# EAGLE schematic LDR (EAGLE 7.2.0)
CNAME: LDR configurations; CREVISION: 1.0; DESIGNER: S.j.de.Bakker@hr.nl
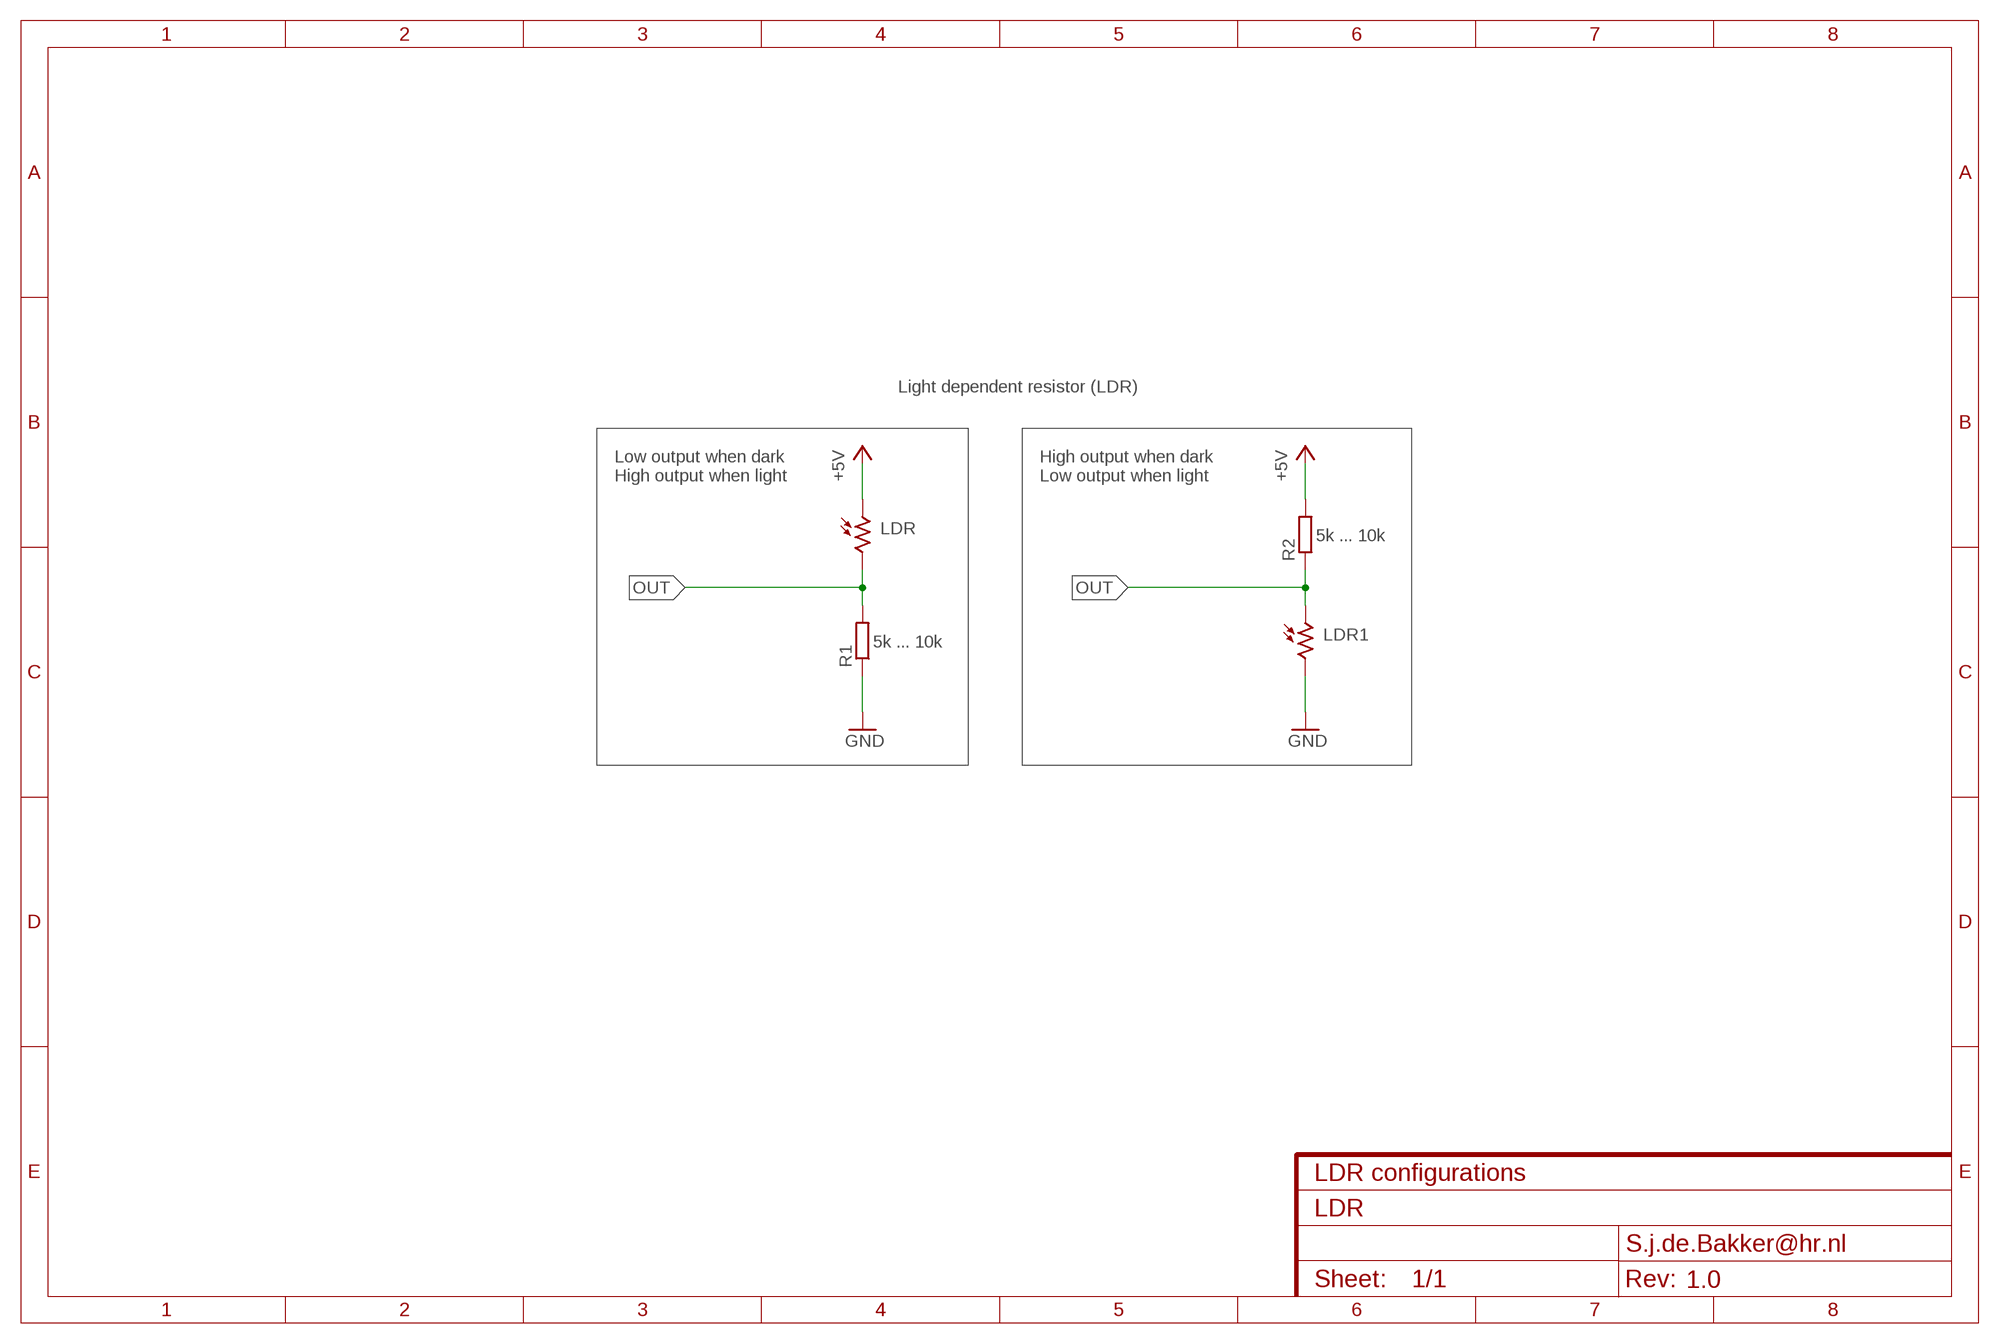
[diagram p0: schematic, sheet 1]

## Parts
LDR  B1060_23  [TO-8_B10]
LDR1  B1060_23  [TO-8_B10]
R1  5k ... 10k  R-EU_VTA52  [VTA52]
R2  5k ... 10k  R-EU_VTA52  [VTA52]

## Nets
+5V: LDR.1 R2.2
GND: LDR1.2 R1.1
OUT: LDR1.1 LDR.2 R1.2 R2.1

## Notes on the sheet
- Light dependent resistor (LDR)
- Low output when dark
  High output when light
- High output when dark
  Low output when light

## Library data of the parts
LDR LDR1 = photo-elements:?1060*: Sensor Street Light control Source: http://optoelectronics.perkinelmer.com/content/Datasheets/DTS_PhotocellsB1060.pdf
R1 R2 = rcl:R-EU_: RESISTOR, European symbol